# EAGLE design p214_001_001 (EAGLE 6.5.0)
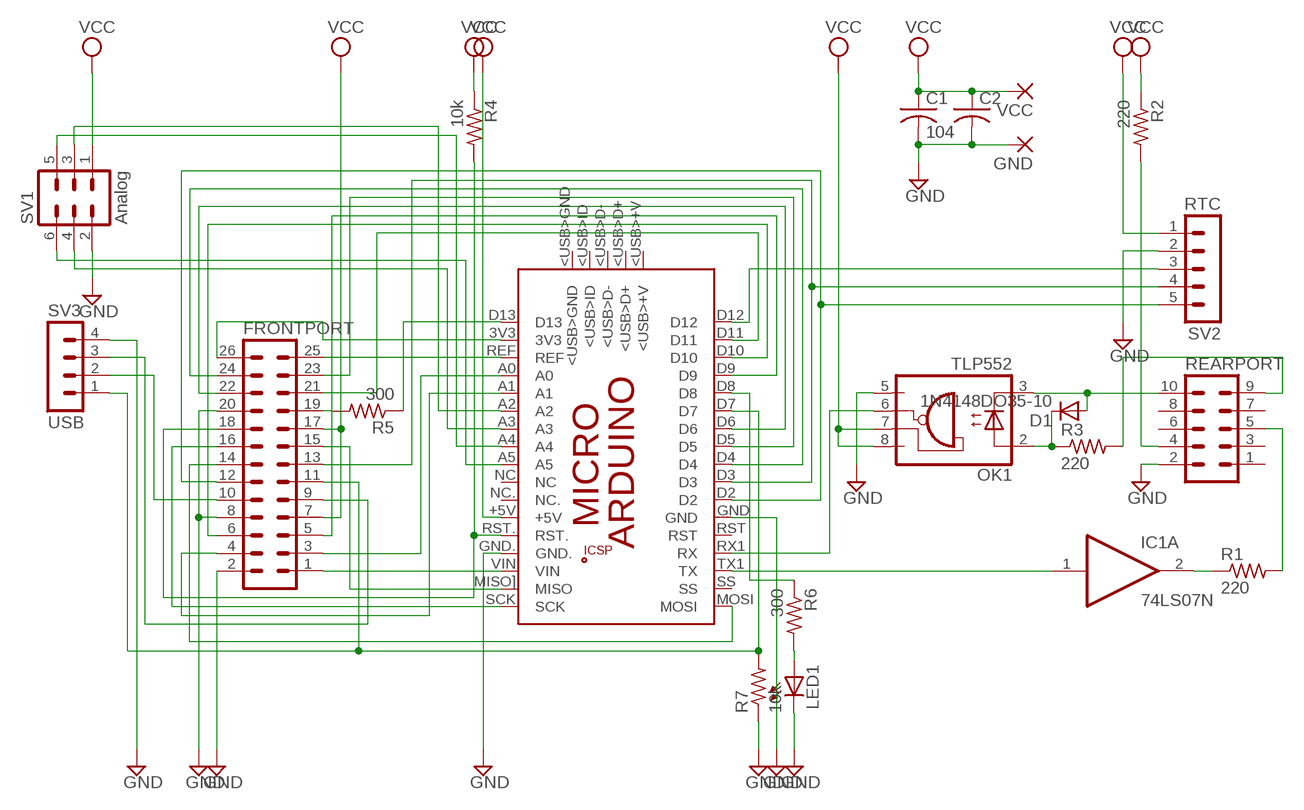
[diagram p0: schematic, sheet 1]

## Parts
C1  104  C-US025-025X050  [C025-025X050]
C2  C-US050-075X075  [C050-075X075]
D1  1N4148DO35-10  [DO35-10]
FRONTPORT  ML26L  [ML26L]
GND  1,6/0,9  [1,6/0,9]
IC1  74LS07N  [DIL14]
LED1  LED3MM  [LED3MM]
OK1  TLP552  6N137  [DIL08]
PCB1  ARDUINO_MICRO  [ARDUINO_MICRO]
R1  220  R-US_0204/7  [0204/7]
R2  220  R-US_0204/7  [0204/7]
R3  220  R-US_0204/7  [0204/7]
R4  10k  R-US_0204/7  [0204/7]
R5  300  R-US_0204/7  [0204/7]
R6  300  R-US_0204/7  [0204/7]
R7  10k  R-US_0204/7  [0204/7]
REARPORT  ML10L  [ML10L]
SV1  Analog  MA03-2  [MA03-2]
SV2  RTC  MA05-1  [MA05-1]
SV3  USB  MA04-1  [MA04-1]
VCC  1,6/0,9  [1,6/0,9]

## Nets
GND: C1.2 C2.2 FRONTPORT.2 FRONTPORT.8 FRONTPORT.20 GND.1(P) LED1.K(C) OK1.5(GND) PCB1.GND PCB1.GND. R7.1 REARPORT.2 SV1.2 SV2.2 SV3.4
N$1: IC1.1(A:I) PCB1.TX1(TX)
N$2: IC1.2(A:O) R1.1
N$3: D1.C OK1.2(A) R3.1
N$4: R2.2 REARPORT.4
N$5: R1.2 REARPORT.5
N$6: R3.2 REARPORT.9
N$7: D1.A OK1.3(C) REARPORT.10
N$8: OK1.6(VO) PCB1.RX1(RX)
N$9: FRONTPORT.3 PCB1.A0
N$10: FRONTPORT.1 PCB1.VIN
N$11: FRONTPORT.4 PCB1.A1
N$12: FRONTPORT.5 PCB1.D9
N$13: FRONTPORT.6 PCB1.D10
N$14: FRONTPORT.14 PCB1.MOSI
N$15: FRONTPORT.15 PCB1.MISO](MISO)
N$16: FRONTPORT.16 PCB1.SCK
N$17: FRONTPORT.12 PCB1.D2 SV2.5
N$18: FRONTPORT.13 PCB1.D3 SV2.4
N$19: FRONTPORT.19 R5.2
N$20: PCB1.D13 R5.1
N$21: FRONTPORT.25 PCB1.REF
N$22: FRONTPORT.9 SV3.3
N$23: FRONTPORT.18 PCB1.RST. R4.2
N$24: FRONTPORT.11 PCB1.D7 R7.2 SV3.1
N$26: FRONTPORT.21 PCB1.D11
N$27: FRONTPORT.22 PCB1.D6
N$28: FRONTPORT.23 PCB1.D5
N$29: FRONTPORT.24 PCB1.D4
N$30: FRONTPORT.26 PCB1.3V3
N$31: PCB1.A2 SV1.3
N$32: PCB1.A3 SV1.4
N$33: PCB1.A4 SV1.5
N$34: PCB1.A5 SV1.6
N$35: PCB1.D8 R6.1
N$36: LED1.A R6.2
N$37: PCB1.D12 SV2.3
N$39: FRONTPORT.10 SV3.2
VCC: C1.1 C2.1 FRONTPORT.7 FRONTPORT.17 OK1.7(VE) OK1.8(VCC) PCB1.+5V R2.1 R4.1 SV1.1 SV2.1 VCC.1(P)
Unconnected: IC1.3(B:I) IC1.4(B:O) IC1.5(C:I) IC1.6(C:O) IC1.8(D:O) IC1.9(D:I) IC1.10(E:O) IC1.11(E:I) IC1.12(F:O) IC1.13(F:I) PCB1.5V PCB1.<USB>+V PCB1.<USB>D+ PCB1.<USB>D- PCB1.<USB>GND PCB1.<USB>ID PCB1.GND_ PCB1.MISO. PCB1.MOSI. PCB1.NC PCB1.NC. PCB1.RESET.. PCB1.RST PCB1.SCK. PCB1.SS REARPORT.1 REARPORT.3 REARPORT.6 REARPORT.7 REARPORT.8

## Power pins joined to a net without a drawn wire
GND: IC1.7(P:GND)
VCC: IC1.14(P:VCC)

## Library data of the parts
C1 C2 = rcl:C-US: CAPACITOR, American symbol
D1 = diode:1N4148: DIODE high speed (Philips)
FRONTPORT = con-ml:ML26L: HARTING; OC_FARNELL: unknown; OC_NEWARK: unknown
GND VCC = wirepad:1,6/0,9: THROUGH-HOLE PAD
IC1 = 74xx-us:74*07: Hex BUFFER, open collector high-voltage output
LED1 = led:LED: LED OSRAM: - CHIPLED LG R971, LG N971, LY N971, LG Q971, LY Q971, LO R971, LY R971 LH N974, LH R974 LS Q976, LO Q976, LY Q976 LO Q996 - Hyper CHIPLED LW Q18S LB Q993, LB Q99A, LB R99A - SideLED LS A670, LO A670, LY A670, LG A670, LP A670 LB A673, LV A673, LT A673, LW A673 LH A674 LY A675 LS A676, LA A676, LO A676, LY A676, LW A676 LS A679, LY A679, LG A679 - Hyper Micro SIDELED® LS Y876, LA Y876, LO Y876, LY Y876 LT Y87S - SmartLED LW L88C, LW L88S LB L89C, LB L89S, LG L890 LS L89K, LO L89K, LY L89K LS L896, LA L896, LO L896, LY L896 - TOPLED LS T670, LO T670, LY T670, LG T670, LP T670 LSG T670, LSP T670, LSY T670, LOP T670, LYG T670 LG T671, LOG T671, LSG T671 LB T673, LV T673, LT T673, LW T673 LH T674 LS T676, LA T676, LO T676, LY T676, LB T676, LH T676, LSB T676, LW T676 LB T67C, LV T67C, LT T67C, LS T67K, LO T67K, LY T67K, LW E67C LS E67B, LA E67B, LO E67B, LY E67B, LB E67C, LV E67C, LT E67C LW T67C LS T679, LY T679, LG T679 LS T770, LO T770, LY T770, LG T770, LP T770 LB T773, LV T773, LT T773, LW T773 LH T774 LS E675, LA E675, LY E675, LS T675 LS T776, LA T776, LO T776, LY T776, LB T776 LHGB T686 LT T68C, LB T68C - Hyper Mini TOPLED® LB M676 - Mini TOPLED Santana® LG M470 LS M47K, LO M47K, LY M47K Source: http://www.osram.convergy.de LUXEON: - LUMILED® LXK2-PW12-R00, LXK2-PW12-S00, LXK2-PW14-U00, LXK2-PW14-V00 LXK2-PM12-R00, LXK2-PM12-S00, LXK2-PM14-U00 LXK2-PE12-Q00, LXK2-PE12-R00, LXK2-PE12-S00, LXK2-PE14-T00, LXK2-PE14-U00 LXK2-PB12-K00, LXK2-PB12-L00, LXK2-PB12-M00, LXK2-PB14-N00, LXK2-PB14-P00, LXK2-PB14-Q00 LXK2-PR12-L00, LXK2-PR12-M00, LXK2-PR14-Q00, LXK2-PR14-R00 LXK2-PD12-Q00, LXK2-PD12-R00, LXK2-PD12-S00 LXK2-PH12-R00, LXK2-PH12-S00 LXK2-PL12-P00, LXK2-PL12-Q00, LXK2-PL12-R00 Source: www.luxeon.com KINGBRIGHT: KA-3528ASYC Source: www.kingbright.com
OK1 = optocoupler:6N137: MOTOROLA OPTO COUPLER; MPN: 6N137; OC_FARNELL: 1328376; OC_NEWARK: 52M1895
PCB1 = E14_Arduino:ARDUINO_MICRO: Device for representing an Arduino Micro board with a footprint in an EAGLE design. Created by Dave Young for Element14. More EAGLE documentation at: http://www.element14.com/community/community/knode/cadsoft_eagle
R1-R7 = resistor:R-US_: RESISTOR, American symbol
REARPORT = con-ml:ML10L: HARTING; OC_FARNELL: unknown; OC_NEWARK: unknown
SV1 = con-lstb:MA03-2: PIN HEADER; OC_FARNELL: unknown; OC_NEWARK: unknown
SV2 = con-lstb:MA05-1: PIN HEADER; OC_FARNELL: unknown; OC_NEWARK: unknown
SV3 = con-lstb:MA04-1: PIN HEADER; OC_FARNELL: unknown; OC_NEWARK: unknown

## Board
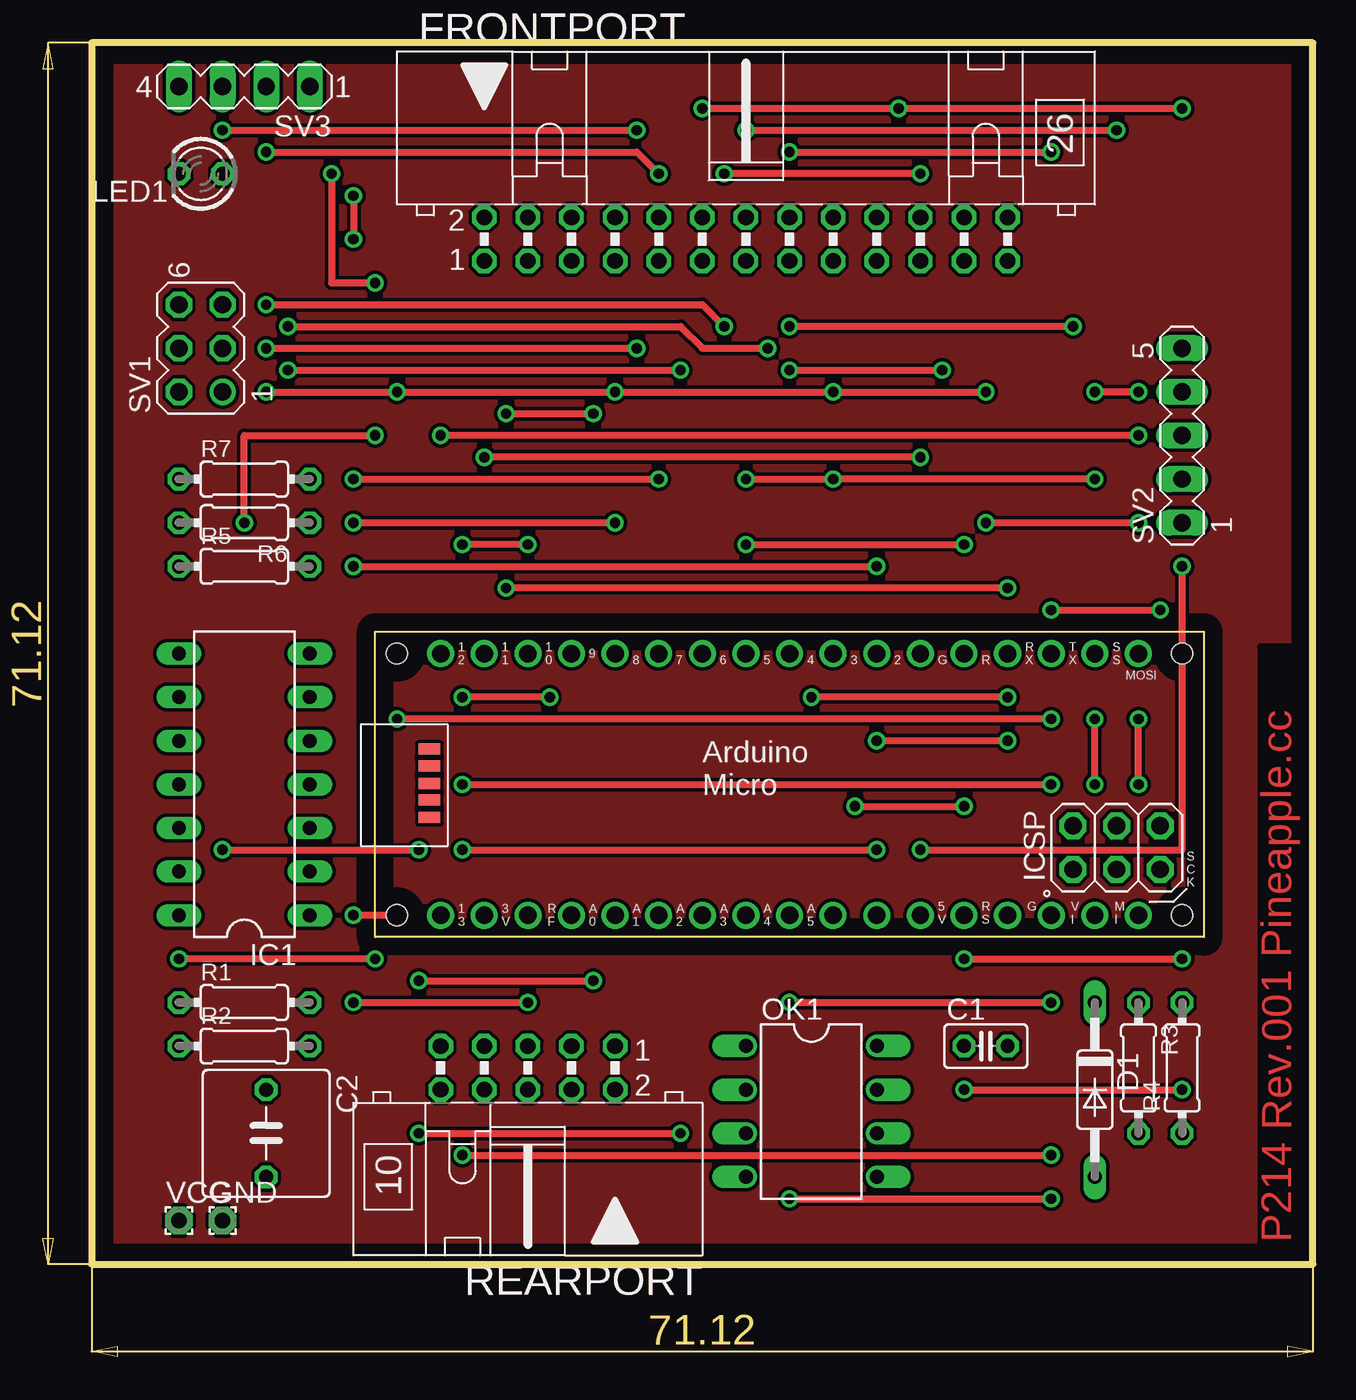
[diagram p1: board, top side]
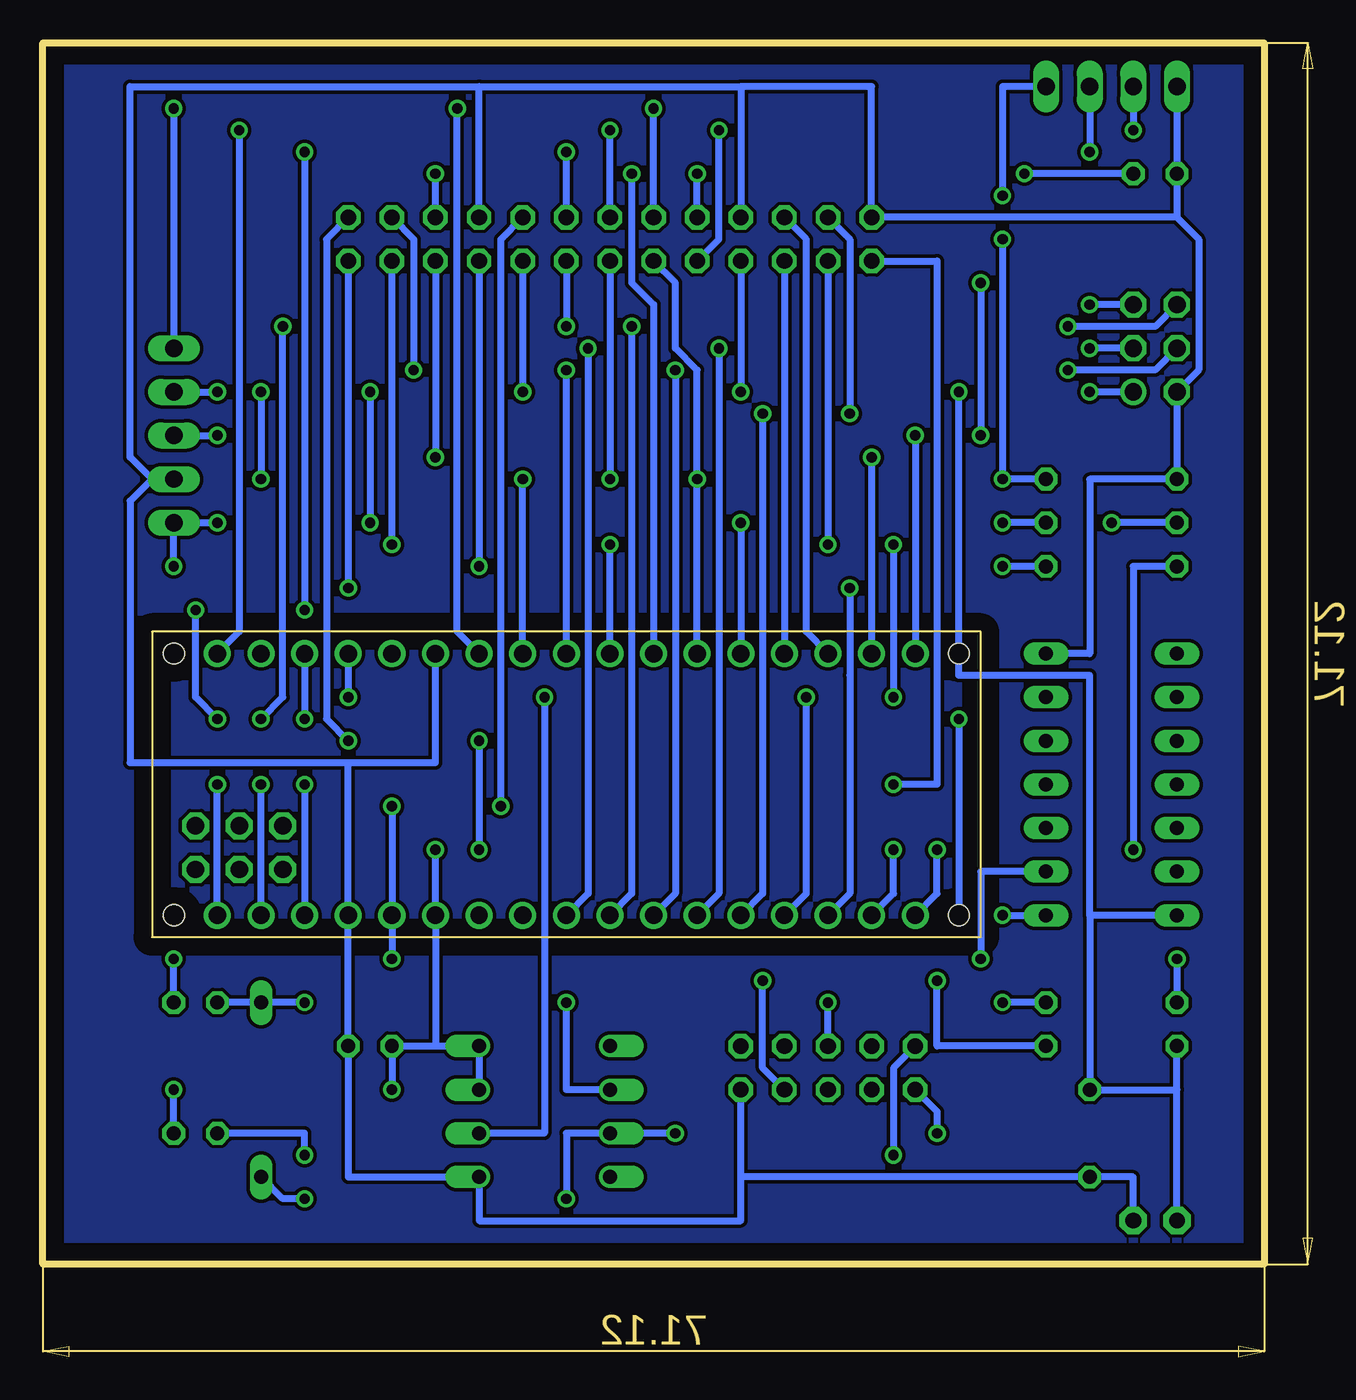
[diagram p2: board, bottom side, seen from below]

Size 71.12 x 71.12 mm. Coordinates in mm from the lower left corner, seen from the top.
Outline: 0,0 71.12,0 71.12,71.12 0,71.12 0,0
Copper layers (1*16): Top 0.035mm / dielectric 1.5mm / Bottom 0.035mm
Design rules "default": minimum track width 10mil, minimum drill 24mil, track to track 8mil, track to pad 8mil, pad to pad 8mil, via to via 8mil, smd to smd 8mil, copper to edge 40mil, drill to drill 8mil, minimum pad ring 10mil, minimum via ring 8mil, stop-mask expansion 4mil, vias tented up to drill 0mil, thermal gap 10mil

### Footprints (pad centres in the part's own frame; a part is rotated, then mirrored left to right if it is on the bottom)
C025-025X050 = drill 0.813 octagon: 1 -1.27,0; 2 1.27,0
C050-075X075 = drill 0.813 octagon: 1 -2.54,0; 2 2.54,0
DO35-10 = drill 0.813 long: A 5.08,0; C -5.08,0
ML26L = drill 0.914 octagon: 1 -15.24,-1.27; 2 -15.24,1.27; 3 -12.7,-1.27; 4 -12.7,1.27; 5 -10.16,-1.27; 6 -10.16,1.27; 7 -7.62,-1.27; 8 -7.62,1.27; 9 -5.08,-1.27; 10 -5.08,1.27; 11 -2.54,-1.27; 12 -2.54,1.27; 13 0,-1.27; 14 0,1.27; 15 2.54,-1.27; 16 2.54,1.27; 17 5.08,-1.27; 18 5.08,1.27; 19 7.62,-1.27; 20 7.62,1.27; 21 10.16,-1.27; 22 10.16,1.27; 23 12.7,-1.27; 24 12.7,1.27; 25 15.24,-1.27; 26 15.24,1.27
1,6/0,9 = drill 0.914 pad 1.6 octagon: 1 0,0
DIL14 = drill 0.813 long: 1 -7.62,-3.81; 2 -5.08,-3.81; 3 -2.54,-3.81; 4 0,-3.81; 5 2.54,-3.81; 6 5.08,-3.81; 7 7.62,-3.81; 8 7.62,3.81; 9 5.08,3.81; 10 2.54,3.81; 11 0,3.81; 12 -2.54,3.81; 13 -5.08,3.81; 14 -7.62,3.81
LED3MM = drill 0.813 octagon: A -1.27,0; K 1.27,0
DIL08 = drill 0.813 offset: 1 -3.81,-3.81; 2 -1.27,-3.81; 3 1.27,-3.81; 4 3.81,-3.81; 5 3.81,3.81; 6 1.27,3.81; 7 -1.27,3.81; 8 -3.81,3.81
ARDUINO_MICRO = drill 1.016 pad 1.575: 3V3 6.35,1.27; +5V 31.75,1.27; A0 11.43,1.27; A1 13.97,1.27; A2 16.51,1.27; A3 19.05,1.27; A4 21.59,1.27; A5 24.13,1.27; D2 29.21,16.51; D3 26.67,16.51; D4 24.13,16.51; D5 21.59,16.51; D6 19.05,16.51; D7 16.51,16.51; D8 13.97,16.51; D9 11.43,16.51; D10 8.89,16.51; D11 6.35,16.51; D12 3.81,16.51; D13 3.81,1.27; GND 31.75,16.51; GND. 36.83,1.27; MISO] 41.91,1.27; MOSI 44.45,16.51; NC 26.67,1.27; NC. 29.21,1.27; REF 8.89,1.27; RST 34.29,16.51; RST. 34.29,1.27; RX1 36.83,16.51; SCK 44.45,1.27; SS 41.91,16.51; TX1 39.37,16.51; VIN 39.37,1.27 | drill 1.016 pad 1.575 octagon: 5V 40.64,6.477; GND_ 45.72,6.477; MISO. 40.64,3.937; MOSI. 43.18,6.477; RESET.. 45.72,3.937; SCK. 43.18,3.937 | smd 1.27 x 0.635: <USB>+V 3.15,10.947; <USB>D+ 3.15,9.957; <USB>D- 3.15,8.941; <USB>GND 3.15,6.96; <USB>ID 3.15,7.976 | hole 1.2: 1.27,1.27; 1.27,16.51; 46.99,16.51; 46.99,1.27
0204/7 = drill 0.813 octagon: 1 -3.81,0; 2 3.81,0
ML10L = drill 0.914 octagon: 1 -5.08,-1.27; 2 -5.08,1.27; 3 -2.54,-1.27; 4 -2.54,1.27; 5 0,-1.27; 6 0,1.27; 7 2.54,-1.27; 8 2.54,1.27; 9 5.08,-1.27; 10 5.08,1.27
MA03-2 = drill 1.016: 1 -2.54,-1.27 | drill 1.016 octagon: 2 -2.54,1.27; 3 0,-1.27; 4 0,1.27; 5 2.54,-1.27; 6 2.54,1.27
MA05-1 = drill 1.016 long: 1 -5.08,0; 2 -2.54,0; 3 0,0; 4 2.54,0; 5 5.08,0
MA04-1 = drill 1.016 long: 1 -3.81,0; 2 -1.27,0; 3 1.27,0; 4 3.81,0

### Placement (x,y rotation side)
C1  52.07,12.7 0 top
C2  10.16,7.62 270 top
D1  58.42,10.16 270 top
FRONTPORT  38.1,59.69 0 top
GND  7.62,2.54 0 top
IC1  8.89,27.94 90 top
LED1  6.35,63.5 180 top
OK1  41.91,8.89 270 top
PCB1  16.51,19.05 0 top
R1  8.89,15.24 0 top
R2  8.89,12.7 0 top
R3  60.96,11.43 270 top
R4  63.5,11.43 90 top
R5  8.89,40.64 0 top
R6  8.89,43.18 180 top
R7  8.89,45.72 0 top
REARPORT  25.4,11.43 180 top
SV1  6.35,53.34 90 top
SV2  63.5,48.26 90 top
SV3  8.89,68.58 180 top
VCC  5.08,2.54 0 top

### Tracks (layer width: path | path; a pad name or v marks a point on that pad's centre or on a via)
GND  (via drill 0.6)
  Bottom 0.406: GND.1 7.62,5.08 C2.2 30.48,5.08 | 30.48,5.08 REARPORT.2 | 30.48,5.08 30.48,2.54 45.72,2.54 OK1.5 53.34,5.08 C1.2 PCB1.GND. 53.34,29.21 | 53.34,29.21 48.26,29.21 PCB1.GND | FRONTPORT.20 45.72,68.58 | 45.72,68.58 30.48,68.58 | 30.48,68.58 FRONTPORT.8 | 30.48,68.58 22.86,68.58 FRONTPORT.2 5.08,60.96 | IC1.7 10.16,35.56 10.16,45.72 R7.1 SV1.2 3.81,52.07 3.81,59.69 5.08,60.96 | 64.77,45.72 66.04,46.99 66.04,68.58 45.72,68.58 | SV2.2 64.77,45.72 | 64.77,45.72 66.04,44.45 66.04,29.21 53.34,29.21 | 5.08,60.96 LED1.K SV3.4
  other vias: 30.48,10.16
N$1  (via drill 0.6)
  Top 0.406: v55.88,31.75 v17.78,31.75 | v17.78,20.32 v15.24,20.32
  Bottom 0.406: PCB1.TX1 v55.88,31.75 | v17.78,31.75 v17.78,20.32 | v15.24,20.32 IC1.1
N$2  (via drill 0.6)
  Top 0.406: v16.51,17.78 v5.08,17.78
  Bottom 0.406: IC1.2 16.51,22.86 v16.51,17.78 | v5.08,17.78 R1.1
N$3  (via drill 0.6)
  Top 0.406: v40.64,15.24 v55.88,15.24
  Bottom 0.406: OK1.2 40.64,10.16 v40.64,15.24 | v55.88,15.24 D1.C R3.1
N$4  (via drill 0.6)
  Top 0.406: v19.05,16.51 v29.21,16.51
  Bottom 0.406: R2.2 19.05,12.7 v19.05,16.51 | REARPORT.4 29.21,11.43 v29.21,16.51
N$5  (via drill 0.6)
  Top 0.406: v15.24,15.24 v25.4,15.24
  Bottom 0.406: R1.2 v15.24,15.24 | REARPORT.5 v25.4,15.24
N$6  (via drill 0.6)
  Top 0.406: v21.59,6.35 v55.88,6.35
  Bottom 0.406: REARPORT.9 21.59,11.43 v21.59,6.35 | v55.88,6.35 55.88,7.62 R3.2
N$7  (via drill 0.6)
  Top 0.406: v19.05,7.62 v34.29,7.62 | v40.64,3.81 v55.88,3.81
  Bottom 0.406: REARPORT.10 19.05,8.89 v19.05,7.62 | v34.29,7.62 OK1.3 40.64,7.62 v40.64,3.81 | v55.88,3.81 57.15,3.81 D1.A
N$8  (via drill 0.6)
  Top 0.406: v53.34,33.02 v41.91,33.02
  Bottom 0.406: PCB1.RX1 v53.34,33.02 | v41.91,33.02 41.91,7.62 OK1.6
N$9  (via drill 0.6)
  Top 0.406: v25.4,41.91 v21.59,41.91 | v26.67,33.02 v21.59,33.02
  Bottom 0.406: PCB1.A0 26.67,21.59 v26.67,33.02 | FRONTPORT.3 v25.4,41.91 | v21.59,41.91 v21.59,33.02
N$10  (via drill 0.6)
  Top 0.406: v21.59,27.94 v55.88,27.94
  Bottom 0.406: FRONTPORT.1 19.05,58.42 19.05,27.94 v21.59,27.94 | v55.88,27.94 PCB1.VIN
N$11  (via drill 0.6)
  Top 0.406: v24.13,49.53 v29.21,49.53
  Bottom 0.406: FRONTPORT.4 24.13,59.69 v24.13,49.53 | v29.21,49.53 29.21,21.59 PCB1.A1
N$12
  Bottom 0.406: FRONTPORT.5 PCB1.D9
N$13
  Bottom 0.406: PCB1.D10 26.67,36.83 26.67,59.69 FRONTPORT.6
N$14  (via drill 0.6)
  Top 0.406: v38.1,66.04 v59.69,66.04
  Bottom 0.406: FRONTPORT.14 v38.1,66.04 | v59.69,66.04 59.69,36.83 PCB1.MOSI
N$15  (via drill 0.6)
  Top 0.406: v58.42,27.94 v58.42,31.75 | v57.15,54.61 v40.64,54.61
  Bottom 0.406: PCB1.MISO] v58.42,27.94 | v58.42,31.75 57.15,33.02 v57.15,54.61 | FRONTPORT.15 v40.64,54.61
N$16  (via drill 0.6)
  Top 0.406: v60.96,27.94 v60.96,31.75 | v40.64,64.77 v55.88,64.77 | v55.88,38.1 v62.23,38.1
  Bottom 0.406: PCB1.SCK v60.96,27.94 | v60.96,31.75 62.23,33.02 v62.23,38.1 | FRONTPORT.16 v40.64,64.77 | v55.88,64.77 v55.88,38.1
N$17  (via drill 0.6)
  Top 0.406: v35.56,67.31 v46.99,67.31 v63.5,67.31
  Bottom 0.406: FRONTPORT.12 v35.56,67.31 | v63.5,67.31 SV2.5 | PCB1.D2 46.99,36.83 v46.99,67.31
N$18  (via drill 0.6)
  Top 0.406: v38.1,45.72 v43.18,45.72 v58.42,45.72 | v60.96,50.8 v58.42,50.8
  Bottom 0.406: FRONTPORT.13 v38.1,45.72 | PCB1.D3 v43.18,45.72 | SV2.4 v60.96,50.8 | v58.42,50.8 v58.42,45.72
N$19  (via drill 0.6)
  Top 0.406: v15.24,40.64 v45.72,40.64
  Bottom 0.406: FRONTPORT.19 v45.72,40.64 | R5.2 v15.24,40.64
N$20  (via drill 0.6)
  Top 0.406: v7.62,24.13 v19.05,24.13
  Bottom 0.406: R5.1 7.62,40.64 v7.62,24.13 | PCB1.D13 19.05,21.59 v19.05,24.13
N$21  (via drill 0.6)
  Top 0.406: v53.34,39.37 v24.13,39.37
  Bottom 0.406: FRONTPORT.25 v53.34,39.37 | v24.13,39.37 24.13,34.29 24.13,21.59 PCB1.REF
N$22  (via drill 0.6)
  Top 0.406: v7.62,66.04 v31.75,66.04
  Bottom 0.406: FRONTPORT.9 31.75,59.69 v31.75,66.04 | SV3.3 v7.62,66.04
N$23  (via drill 0.6)
  Top 0.406: v50.8,17.78 v63.5,17.78 | v44.45,26.67 v50.8,26.67
  Bottom 0.406: v50.8,17.78 PCB1.RST. v50.8,26.67 | R4.2 v63.5,17.78 | v44.45,26.67 44.45,59.69 FRONTPORT.18
  other vias: 43.18,60.96
N$24  (via drill 0.6)
  Top 0.406: v15.24,62.23 v15.24,59.69 | v15.24,45.72 v33.02,45.72
  Bottom 0.406: SV3.1 15.24,68.58 v15.24,62.23 | PCB1.D7 v33.02,45.72 33.02,52.07 34.29,53.34 34.29,57.15 FRONTPORT.11 | R7.2 v15.24,45.72 v15.24,59.69
N$25
  pour Top: 1.27,1.27 69.85,1.27 69.85,69.85 1.27,69.85
N$26  (via drill 0.6)
  Top 0.406: v48.26,46.99 v22.86,46.99
  Bottom 0.406: FRONTPORT.21 v48.26,46.99 | v22.86,46.99 PCB1.D11
N$27  (via drill 0.6)
  Top 0.406: v48.26,63.5 v36.83,63.5
  Bottom 0.406: FRONTPORT.22 v48.26,63.5 | v36.83,63.5 36.83,57.15 35.56,55.88 PCB1.D6
N$28  (via drill 0.6)
  Top 0.406: v38.1,41.91 v50.8,41.91
  Bottom 0.406: PCB1.D5 v38.1,41.91 | v50.8,41.91 FRONTPORT.23
N$29  (via drill 0.6)
  Top 0.406: v40.64,52.07 v49.53,52.07
  Bottom 0.406: PCB1.D4 v40.64,52.07 | FRONTPORT.24 49.53,59.69 v49.53,52.07
N$30  (via drill 0.6)
  Top 0.406: v53.34,30.48 v45.72,30.48 | v21.59,24.13 v45.72,24.13
  Bottom 0.406: FRONTPORT.26 54.61,59.69 54.61,31.75 v53.34,30.48 | v45.72,30.48 v45.72,24.13 | PCB1.3V3 21.59,21.59 v21.59,24.13
N$31  (via drill 0.6)
  Top 0.406: v10.16,53.34 v31.75,53.34
  Bottom 0.406: SV1.3 v10.16,53.34 | v31.75,53.34 31.75,21.59 PCB1.A2
N$32  (via drill 0.6)
  Top 0.406: v11.43,52.07 v34.29,52.07
  Bottom 0.406: SV1.4 6.35,52.07 v11.43,52.07 | v34.29,52.07 34.29,21.59 PCB1.A3
N$33  (via drill 0.6)
  Top 0.406: v10.16,55.88 35.56,55.88 v36.83,54.61
  Bottom 0.406: SV1.5 v10.16,55.88 | v36.83,54.61 36.83,21.59 PCB1.A4
N$34  (via drill 0.6)
  Top 0.406: v11.43,54.61 34.29,54.61 35.56,53.34 v39.37,53.34
  Bottom 0.406: SV1.6 6.35,54.61 v11.43,54.61 | v39.37,53.34 39.37,21.59 PCB1.A5
N$35  (via drill 0.6)
  Top 0.406: v15.24,43.18 v30.48,43.18
  Bottom 0.406: R6.1 v15.24,43.18 | v30.48,43.18 PCB1.D8
N$36  (via drill 0.6)
  Top 0.406: v13.97,63.5 13.97,57.15 v16.51,57.15 | v8.89,43.18 8.89,48.26 v16.51,48.26
  Bottom 0.406: LED1.A v13.97,63.5 | v16.51,57.15 v16.51,48.26 | R6.2 v8.89,43.18
N$37  (via drill 0.6)
  Top 0.406: v60.96,48.26 v20.32,48.26
  Bottom 0.406: SV2.3 v60.96,48.26 | v20.32,48.26 PCB1.D12
N$38
  pour Bottom: 1.27,69.85 69.85,69.85 69.85,1.27 1.27,1.27
N$39  (via drill 0.6)
  Top 0.406: v10.16,64.77 31.75,64.77 v33.02,63.5
  Bottom 0.406: FRONTPORT.10 v33.02,63.5 | SV3.2 v10.16,64.77
VCC  (via drill 0.6)
  Top 0.406: v50.8,10.16 v63.5,10.16 | v10.16,50.8 v17.78,50.8 v30.48,50.8 v43.18,50.8 v52.07,50.8 | v52.07,43.18 v60.96,43.18 | v48.26,24.13 63.5,24.13 v63.5,40.64
  Bottom 0.406: VCC.1 5.08,10.16 | 5.08,10.16 R2.1 | 5.08,10.16 C2.1 10.16,20.32 | IC1.14 10.16,20.32 | 10.16,20.32 10.16,34.29 17.78,34.29 v17.78,50.8 | FRONTPORT.7 v30.48,50.8 | 48.26,12.7 C1.1 v50.8,10.16 | 48.26,12.7 OK1.8 OK1.7 | 48.26,12.7 PCB1.+5V v48.26,24.13 | FRONTPORT.17 v43.18,50.8 | v60.96,43.18 SV2.1 v63.5,40.64 | R4.1 v63.5,10.16 | SV1.1 v10.16,50.8 | v52.07,50.8 v52.07,43.18

### Text on the board
Top: P214 Rev.001 Pineapple.cc